# EAGLE schematic stereo_trigger_arduino (EAGLE 8.5.0)
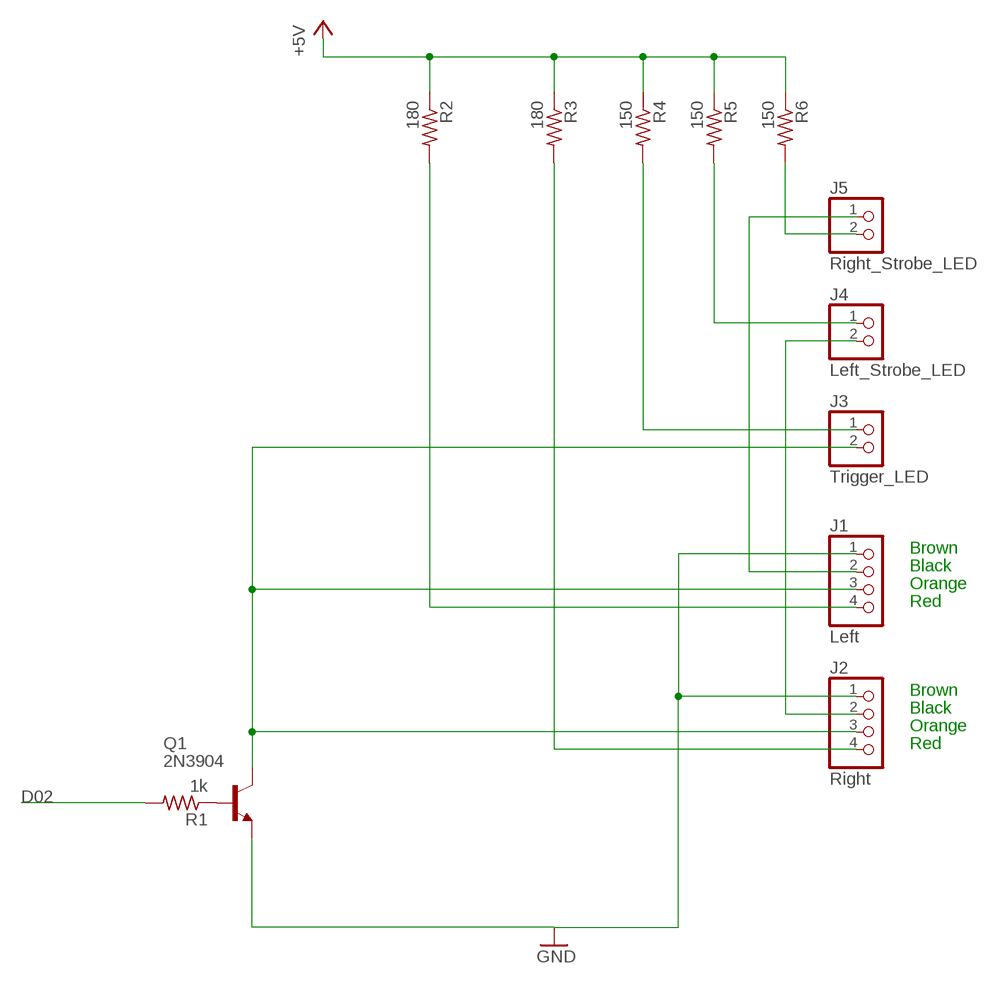
[diagram p0: schematic, sheet 1]

## Parts
J1  Left  PINHD-1X4  [1X04]
J2  Right  PINHD-1X4  [1X04]
J3  Trigger_LED  PINHD-1X2  [1X02]
J4  Left_Strobe_LED  PINHD-1X2  [1X02]
J5  Right_Strobe_LED  PINHD-1X2  [1X02]
Q1  2N3904  [TO92]
R1  1k  R-US_0204/5  [0204/5]
R2  180  R-US_0204/5  [0204/5]
R3  180  R-US_0204/5  [0204/5]
R4  150  R-US_0204/5  [0204/5]
R5  150  R-US_0204/5  [0204/5]
R6  150  R-US_0204/5  [0204/5]

## Nets
+5V: R2.1 R3.1 R4.1 R5.1 R6.1
D02: R1.2
GND: J1.1 Q1.3(E)
N$1: Q1.2(B) R1.1
N$2: J1.4 R2.2
N$3: J2.4 R3.2
N$4: J1.3 J2.3 J3.2 Q1.1(C)
N$5: J3.1 R4.2
N$6: J4.1 R5.2
N$7: J2.2 J4.2
N$8: J5.2 R6.2
N$9: J1.2 J5.1
N$11: J2.1

## Notes on the sheet
- Brown
- Black
- Orange
- Red
- Brown
- Black
- Orange
- Red

## Library data of the parts
J1 J2 = pinhead:PINHD-1X4: PIN HEADER
J3-J5 = pinhead:PINHD-1X2: PIN HEADER
Q1 = transistor-npn:2N3904: NPN Transistor
R1-R6 = resistor:R-US_: RESISTOR, American symbol